# Altium schematic sheet 06_USB_Type-C_DFP.SchDoc: USB-C Connectors
size A2; Organization: Greenfield Tech Solutions; Address1: Molendreef 33; Address2: Ossendrecht; Address3: 4641CS; Address4: The Netherlands; SheetNumber: 6; SheetTotal: 11
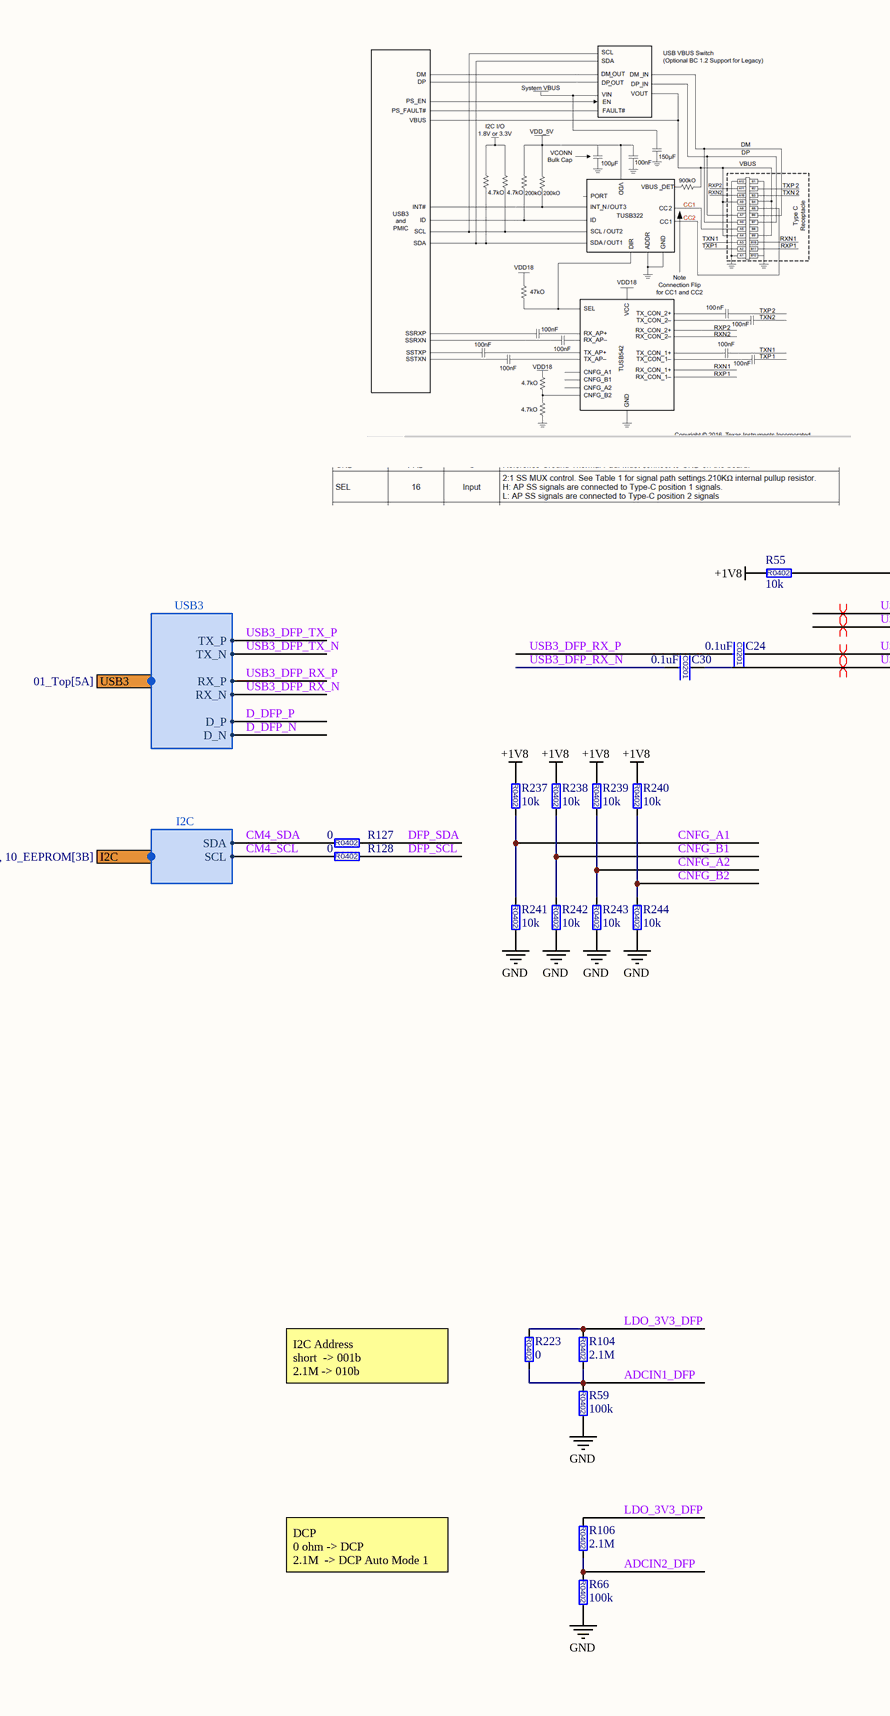
[diagram p0: 06_USB_Type-C_DFP.SchDoc, left]
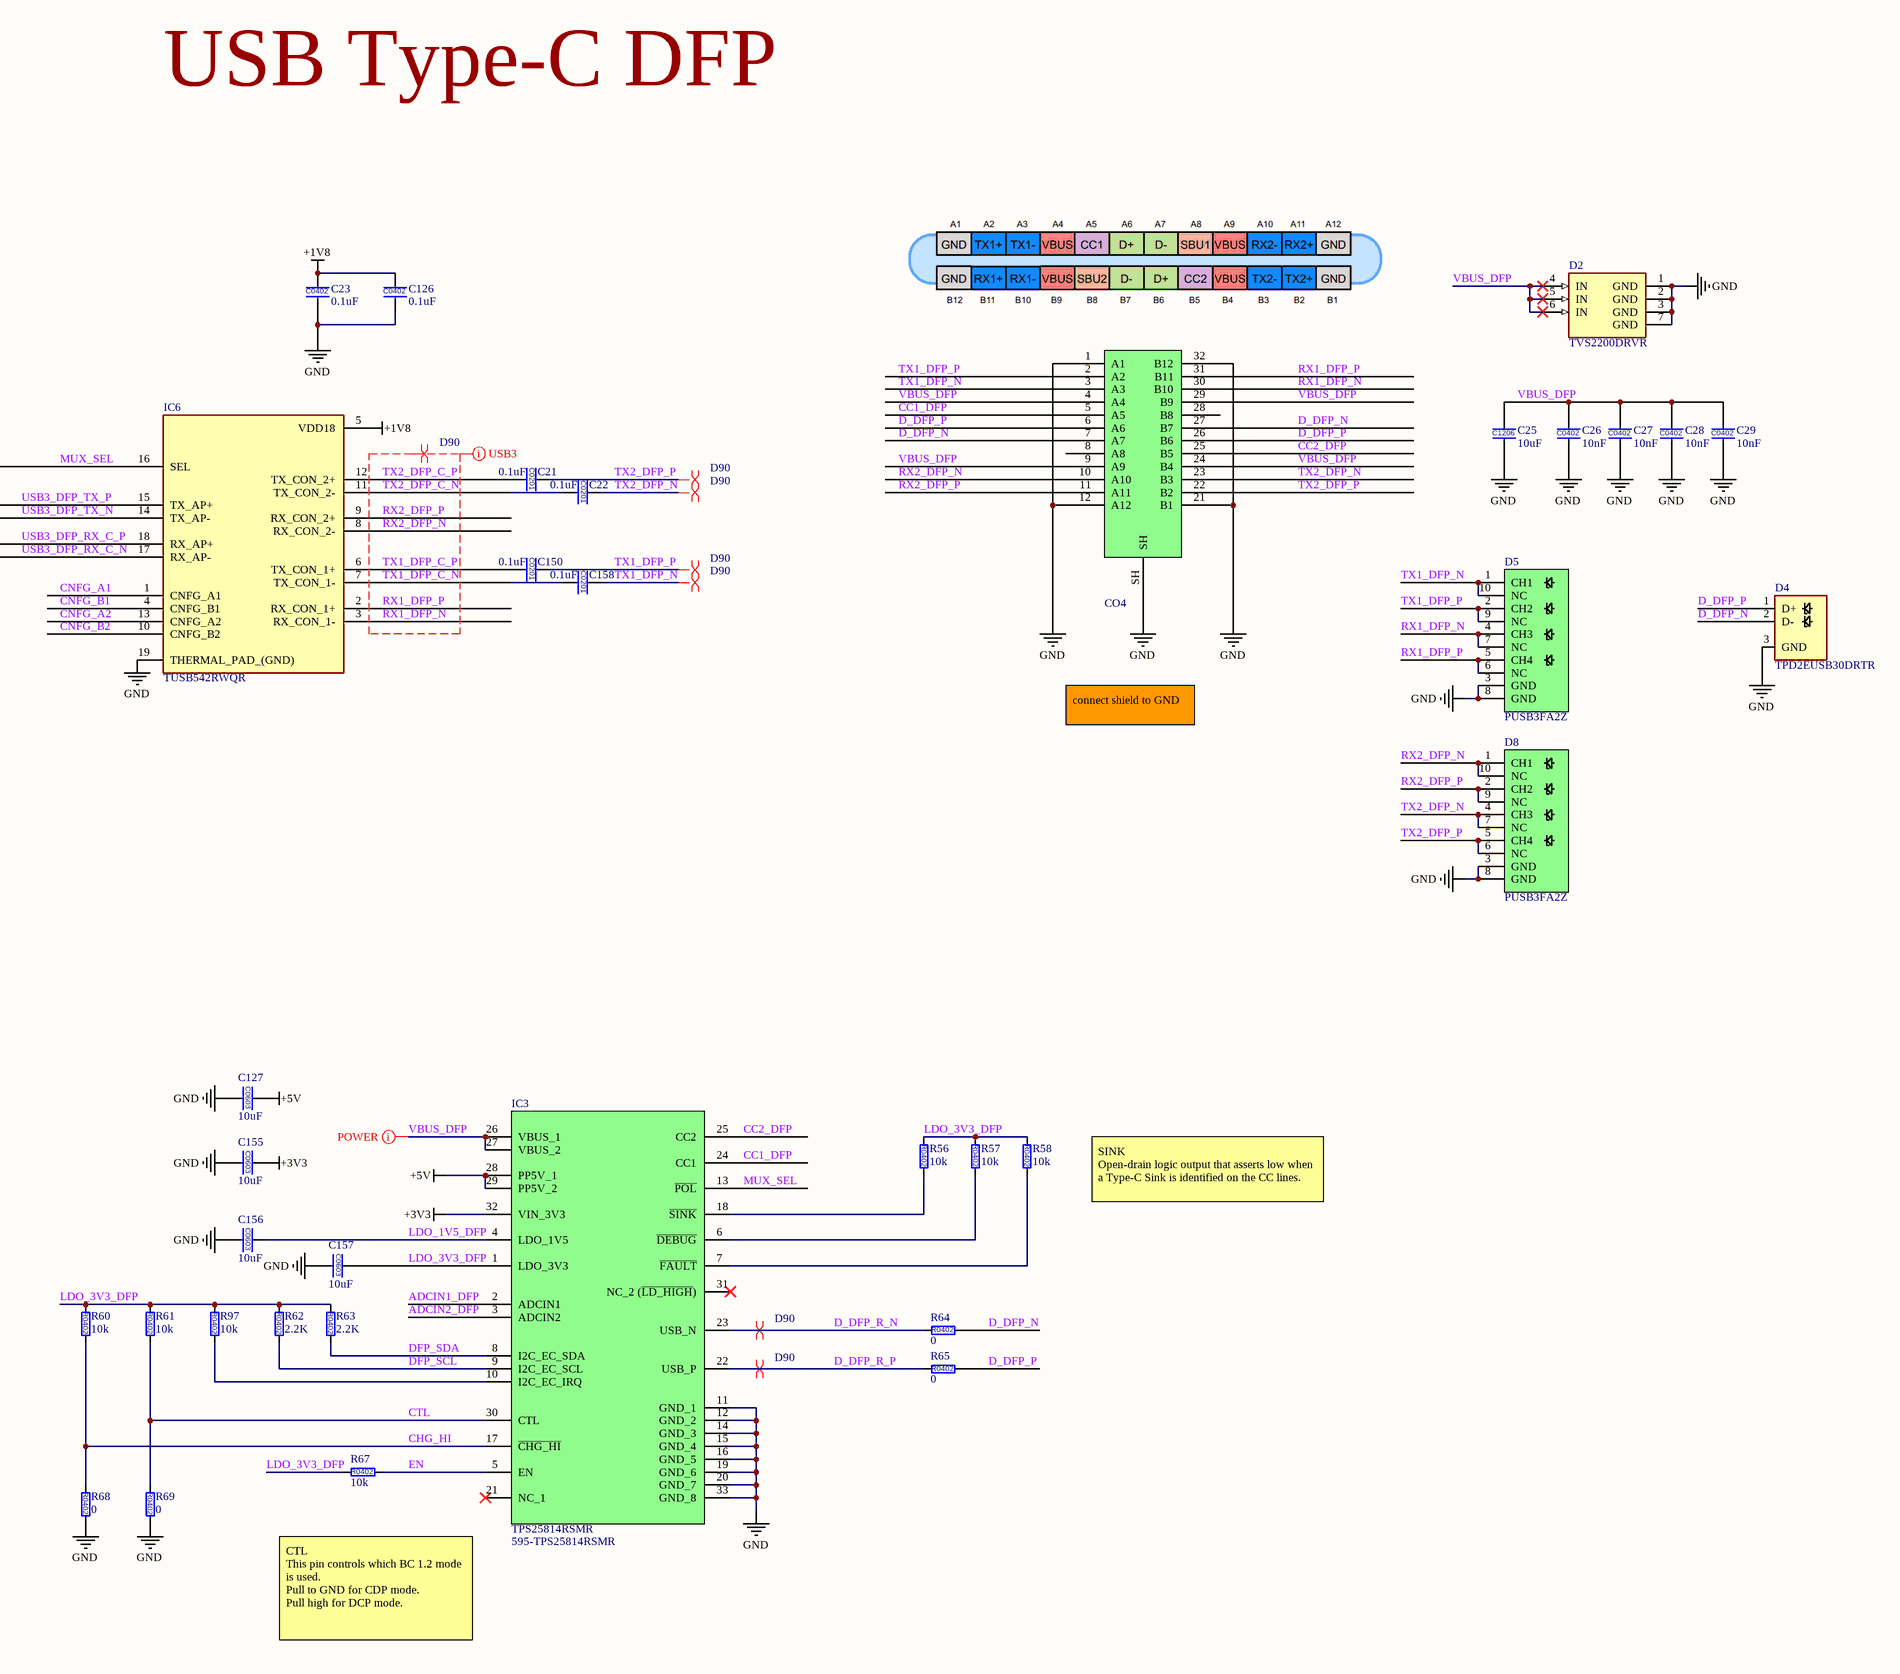
[diagram p1: 06_USB_Type-C_DFP.SchDoc, right]

## Parts
C21  0.1uF  [C0201]
C22  0.1uF  [C0201]
C23  0.1uF  [C0402]
C24  0.1uF  [C0201]
C25  10uF  [C1206]
C26  10nF  [C0402]
C27  10nF  [C0402]
C28  10nF  [C0402]
C29  10nF  [C0402]
C30  0.1uF  [C0201]
C126  0.1uF  [C0402]
C127  10uF  [C0603]
C150  0.1uF  [C0201]
C155  10uF  [C0603]
C156  10uF  [C0603]
C157  10uF  [C0603]
C158  0.1uF  [C0201]
CO4  USB4070-30-C  [USB4070-30-C]  (value not drawn)
D2  TVS2200DRVR  [TVS2200D_SON_6]
D4  TPD2EUSB30DRTR  [TPD2EUSB30DRTR_SOT-3]
D5  PUSB3FA2Z  [PUSB3FA2Z_DFN_2510_10]
D8  PUSB3FA2Z  [PUSB3FA2Z_DFN_2510_10]
IC3  TPS25814RSMR  Supplier Part Number 1: 595-TPS25814RSMR  [TPS25814RSMR_VQFN_32]
IC6  TUSB542RWQR  [TUSB542_X2QFN_18]
R55  10k  [R0402]
R56  10k  [R0402]
R57  10k  [R0402]
R58  10k  [R0402]
R59  100k  [R0402]
R60  10k  [R0402]
R61  10k  [R0402]
R62  2.2K  [R0402]
R63  2.2K  [R0402]
R64  0  [R0402]
R65  0  [R0402]
R66  100k  [R0402]
R67  10k  [R0402]
R68  0  [R0402]
R69  0  [R0402]
R97  10k  [R0402]
R104  2.1M  [R0402]
R106  2.1M  [R0402]
R127  0  [R0402]
R128  0  [R0402]
R223  0  [R0402]
R237  10k  [R0402]
R238  10k  [R0402]
R239  10k  [R0402]
R240  10k  [R0402]
R241  10k  [R0402]
R242  10k  [R0402]
R243  10k  [R0402]
R244  10k  [R0402]

## Ports
I2C (harness I2C, see 01_Top[4A], 03_RPiCM4[1B], 05_HDMI_to_DP[1B], 07_USB_Type-C_DFP_DP_ALT[1B], 08_USB_Type-C_DFP_DP_ALT_buttom[1B], 09_RTC[3B], 10_EEPROM[3B]), USB3 (harness USB3, see 01_Top[5A])

## Harnesses
USB3: TX_P, TX_N, RX_P, RX_N, D_P, D_N
I2C: SDA, SCL

## Nets
+1V8: C23.1 C126.1 IC6.5(VDD18) R55.1 R237.1 R238.1 R239.1 R240.1
+3V3: C155.1 IC3.32(VIN_3V3)
+5V: C127.1 IC3.28(PP5V_1) IC3.29(PP5V_2)
GND: C23.2 C25.2 C26.2 C27.2 C28.2 C29.2 C126.2 C127.2 C155.2 C156.2 C157.2 CO4.1(A1) CO4.12(A12) CO4.21(B1) CO4.32(B12) CO4.SH D2.1(GND) D2.2(GND) D2.3(GND) D2.7(GND) D4.3(GND) D5.3(GND) D5.8(GND) D8.3(GND) D8.8(GND) IC3.11(GND_1) IC3.12(GND_2) IC3.14(GND_3) IC3.15(GND_4) IC3.16(GND_5) IC3.19(GND_6) IC3.20(GND_7) IC3.33(GND_8) IC6.19(THERMAL_PAD_(GND)) R59.2 R66.2 R68.2 R69.2 R241.2 R242.2 R243.2 R244.2
ADCIN1_DFP: IC3.2(ADCIN1) R59.1 R104.2 R223.2
ADCIN2_DFP: IC3.3(ADCIN2) R66.1 R106.2
CC1_DFP: CO4.5(A5) IC3.24(CC1)
CC2_DFP: CO4.25(B5) IC3.25(CC2)
CHG_HI: IC3.17(~{CHG_HI}) R60.2 R68.1
CM4_SCL: R128.1 ; port I2C.SCL
CM4_SDA: R127.1 ; port I2C.SDA
CNFG_A1: IC6.1(CNFG_A1) R237.2 R241.1
CNFG_A2: IC6.13(CNFG_A2) R239.2 R243.1
CNFG_B1: IC6.4(CNFG_B1) R238.2 R242.1
CNFG_B2: IC6.10(CNFG_B2) R240.2 R244.1
CTL: IC3.30(CTL) R61.2 R69.1
D_DFP_N: CO4.7(A7) CO4.27(B7) D4.2(D-) R64.2 ; port USB3.D_N
D_DFP_P: CO4.6(A6) CO4.26(B6) D4.1(D+) R65.2 ; port USB3.D_P
D_DFP_R_N: IC3.23(USB_N) R64.1
D_DFP_R_P: IC3.22(USB_P) R65.1
DFP_SCL: IC3.9(I2C_EC_SCL) R62.2 R128.2
DFP_SDA: IC3.8(I2C_EC_SDA) R63.2 R127.2
EN: IC3.5(EN) R67.2
LDO_1V5_DFP: C156.1 IC3.4(LDO_1V5)
LDO_3V3_DFP: C157.1 IC3.1(LDO_3V3) R56.1 R57.1 R58.1 R60.1 R61.1 R62.1 R63.1 R67.1 R97.1 R104.1 R106.1 R223.1
MUX_SEL: IC3.13(~{POL}) IC6.16(SEL) R55.2
RX1_DFP_N: CO4.30(B10) D5.4(CH3) D5.7(NC) IC6.3(RX_CON_1-)
RX1_DFP_P: CO4.31(B11) D5.5(CH4) D5.6(NC) IC6.2(RX_CON_1+)
RX2_DFP_N: CO4.10(A10) D8.1(CH1) D8.10(NC) IC6.8(RX_CON_2-)
RX2_DFP_P: CO4.11(A11) D8.2(CH2) D8.9(NC) IC6.9(RX_CON_2+)
TX1_DFP_C_N: C158.2 IC6.7(TX_CON_1-)
TX1_DFP_C_P: C150.2 IC6.6(TX_CON_1+)
TX1_DFP_N: C158.1 CO4.3(A3) D5.1(CH1) D5.10(NC)
TX1_DFP_P: C150.1 CO4.2(A2) D5.2(CH2) D5.9(NC)
TX2_DFP_C_N: C22.2 IC6.11(TX_CON_2-)
TX2_DFP_C_P: C21.2 IC6.12(TX_CON_2+)
TX2_DFP_N: C22.1 CO4.23(B3) D8.4(CH3) D8.7(NC)
TX2_DFP_P: C21.1 CO4.22(B2) D8.5(CH4) D8.6(NC)
USB3_DFP_RX_C_N: C30.1 IC6.17(RX_AP-)
USB3_DFP_RX_C_P: C24.1 IC6.18(RX_AP+)
USB3_DFP_RX_N: C30.2 ; port USB3.RX_N
USB3_DFP_RX_P: C24.2 ; port USB3.RX_P
USB3_DFP_TX_N: IC6.14(TX_AP-) ; port USB3.TX_N
USB3_DFP_TX_P: IC6.15(TX_AP+) ; port USB3.TX_P
VBUS_DFP: C25.1 C26.1 C27.1 C28.1 C29.1 CO4.4(A4) CO4.9(A9) CO4.24(B4) CO4.29(B9) D2.4(IN) D2.5(IN) D2.6(IN) IC3.26(VBUS_1) IC3.27(VBUS_2)
NetIC3_6: IC3.6(~{DEBUG}) R57.2
NetIC3_7: IC3.7(~{FAULT}) R58.2
NetIC3_10: IC3.10(I2C_EC_IRQ) R97.2
NetIC3_18: IC3.18(~{SINK}) R56.2

Not connected (* = marked no-connect by the designer): CO4 8(A8) 28(B8); IC3 21(NC_1)* 31(NC_2_(~{LD_HIGH}))*

## Layout directives
differential pair; differential pair class USB3: USB3_DFP_RX_C_N, USB3_DFP_RX_C_P, USB3_DFP_TX_N, USB3_DFP_TX_P
net class USB3: RX1_DFP_N, RX1_DFP_P, RX2_DFP_N, RX2_DFP_P, TX1_DFP_C_N, TX1_DFP_C_P, TX2_DFP_C_N, TX2_DFP_C_P
differential pair; differential pair class D90: D_DFP_R_N, D_DFP_R_P, RX1_DFP_N, RX1_DFP_P, RX2_DFP_N, RX2_DFP_P, TX1_DFP_C_N, TX1_DFP_C_P, TX1_DFP_N, TX1_DFP_P, TX2_DFP_C_N, TX2_DFP_C_P, TX2_DFP_N, TX2_DFP_P
net class POWER: VBUS_DFP

## Notes on the sheet
- USB Type-C DFP
- connect shield to GND
- SINK
  Open-drain logic output that asserts low when a Type-C Sink is identified on the CC lines.
- I2C Address
  short  -> 001b
  2.1M -> 010b
- DCP
  0 ohm -> DCP
  2.1M  -> DCP Auto Mode 1
- CTL
  This pin controls which BC 1.2 mode is used.
  Pull to GND for CDP mode.
  Pull high for DCP mode.
- Title
- Size:
- Date:
- File:
- A2
- Number:
- Time:
- Revision:
- Sheet
- of
- (in symbol 0603ZD106KAT2A) C0603
- (in symbol 02016D104KAT) C0201
- (in symbol 04023D104KAT2A) C0402
- (in symbol 04025C103JAT2A) C0402
- (in symbol 12065D106KAT4A) C1206
- (in symbol CRCW04022K20FK) R0402
- (in symbol CRCW04022M10FKED) R0402
- (in symbol CRCW040210K0FK) R0402
- (in symbol CRCW0402100KFKEDC) R0402
- (in symbol CRCW04020000Z0) R0402

## Library data of the parts
C21 C22 C24 C30 C150 C158 = 02016D104KAT: CAP CER  0.1uF 10% 6.3V X5R 0201; Manufacturer: AVX Corporation; Capacitance: 100nF; Category: Capacitors; Manufacturer Part Number: 02016D104KAT; Operating Temperature: -55°C ~ 85°C; Package / Case: 0201; Value: 0.1uF; Voltage - Rated: 6.3V; Supplier: Digi-Key; Tolerance: ±10%; Temperature Coefficient: X5R; Mounting Type: Surface Mount, MLCC
C23 C126 = 04023D104KAT2A: CAP CER  0.1uF 10% 25V X5R 0402; Manufacturer: AVX Corporation; Manufacturer Part Number: 04023D104KAT2A; Value: 0.1uF; Voltage - Rated: 25V; Tolerance: ±10%; Temperature Coefficient: X5R
C25 = 12065D106KAT4A: CAP CER  10uF 10% 50V X5R 1206; Manufacturer: KYOCERA AVX; Value: 10µF; check: ok; Manufacturer Part Number: 12065D106KAT4A; Tolerance: ±10%; Voltage - Rated: 50V; Temperature Coefficient: X5R
C26-C29 = 04025C103JAT2A: CAP CER 10nF 5% 50V X7R 0402; Manufacturer: KYOCERA AVX; Manufacturer Part Number: 04025C103JAT2A; Operating Temperature: -55°C ~ 125°C; Package / Case: 0402 (1005 Metric); Value: 10nF; Voltage - Rated: 50V; Tolerance: ±5%; Temperature Coefficient: X7R
C127 C155-C157 = 0603ZD106KAT2A: CAP CER 10uF 10% 10V X5R 0603; Manufacturer: KYOCERA AVX; Value: 10µF; Manufacturer Part Number: 0603ZD106KAT2A; Tolerance: ±10%; Voltage - Rated: 10V; Temperature Coefficient: X5R
CO4 = USB4070-30-C: 24 Position 20 VDC USB Type C Horizontal USB 3.1 Receptacle Connector; Part Number: CO0021; Manufacturer: Global Connector Technology; ID: 16; USB Standard: USB 3.1; Number of Contacts: 24; Number of Ports: 1; Mating Cycles: 10000; Shielding: Shielded; ManfactPart: USB4070-30-C; Supplier 1: Farnell; Manufacturer Part Number: USB4070-30-C; RoHS: No; Category: USB Connectors; Stock 1: 87; Pricing 1: 1=3.37000, 10=2.90000, 30=2.83000, 80=2.69000, 200=2.64000 (GBP); Mount: Surface Mount,Through Hole,Vertical; Contact Material: Copper Alloy; Contact Plating: Gold; Insulation Color: Black; Min Operating Temperature: -40°C; Max Operating Temperature: 85°C; Gender: Receptacle; Orientation: Vertical; Connector Type: USB; Series: USB4070; Packaging: Tape and Reel; Termination: Solder; Reach SVHC Compliant: Yes; Lead Free: Lead Free; Flammability Rating: UL94 V-0; ComponentLink1URL: http://www.farnell.com/datasheets/2342947.pdf?src-supplier=Farnell; ComponentLink1Description: http://www.farnell.com/datasheets/2342947.pdf?src-supplier=Farnell; ComponentLink2URL: http://www.farnell.com/cad/2113628.pdf?src-supplier=Element14; ComponentLink2Description: http://www.farnell.com/cad/2113628.pdf?src-supplier=Element14; ComponentLink3URL: http://www.farnell.com/datasheets/2342947.pdf?src-supplier=Newark; ComponentLink3Description: http://www.farnell.com/datasheets/2342947.pdf?src-supplier=Newark; RefVal: USB4070; Supplier Part Number 1: 2784985
D2 = TVS2200DRVR: 22-V flat-clamp surge protection device 6-WSON -40 to 125; Manufacturer: Texas Instruments; Reverse Standoff Voltage: 22V; Standoff Height: 0mm; Clamping Voltage: 27.7V; Number Of Channels: 1; Capacitance: 105pF; Value: 105pF; Direction: Unidirectional; Breakdown Voltage: 24.6V; Peak Pulse Current: 40A; Package: DRV0006A; Category: Diode; Device Class L3: unset; Device Class L1: Circuit Protection; Temperature: -40°C to +125°C; ComponentLink2Description: Datasheet; Height: 0.8mm; Ambient Temperature Range Low: -40°C; Octopart: https://octopart.com/tvs2200drvr-texas+instruments-88217346; Temperature Range High: +125°C; Automotive: No; Temperature Range Low: -40°C; Ipc Land Pattern Name: DFN200X200X75-6; Manufacturer Part Number: TVS2200DRVR; Device Class L2: ESD and Circuit Protection ICs; RoHS: TRUE; Lead Free: Yes; Ambient Temperature Range High: +125°C; Mouser Description: Diode TVS Single Uni-Dir 22V 1.12KW 6-Pin WSON EP T/R; ComponentLink2URL: http://www.ti.com/lit/ds/symlink/tvs2200.pdf; Digikey Description: UNIDIR PRECISION SURGE DIODE; Supplier 1: Mouser; Pricing 1: 1=0.56000, 10=0.47800, 50=0.44600, 100=0.35700, 1000=0.21700, 10000=0.19700 (USD); Mount: Surface Mount; Min Operating Temperature: -40°C; Max Operating Temperature: 125°C; Packaging: Tape and Reel; Number of Circuits: 1; RoHS Compliant: Yes; ComponentLink1URL: http://www.ti.com/lit/ds/symlink/tvs2200.pdf?src-supplier=Digi-Key; ComponentLink1Description: http://www.ti.com/lit/ds/symlink/tvs2200.pdf?src-supplier=Digi-Key; ComponentLink3URL: http://www.ti.com/general/docs/suppproductinfo.tsp?distId=10&amp;gotoUrl=http%3A%2F%2Fwww.ti.com%2Flit%2Fgpn%2Ftvs2200&src-supplier=Digi-Key; ComponentLink3Description: http://www.ti.com/general/docs/suppproductinfo.tsp?distId=10&amp;gotoUrl=http%3A%2F%2Fwww.ti.com%2Flit%2Fgpn%2Ftvs2200&src-supplier=Digi-Key; Supplier Part Number 1: 595-TVS2200DRVR
D4 = TPD2EUSB30DRTR: Dual 0.7-pF, 5.5-V ±8-kV ESD protection diode with 5-A surge rating for USB 3.0 3-SOT-9X3 -40 to 85; Manufacturer: Texas Instruments; Direction: Bidirectional,Unidirectional; Capacitance: 0.8pF; Number of Bidirectional Channels: 2; Reverse Standoff Voltage: 5.5V; Min Breakdown Voltage: 9V; Clamping Voltage: 8V; Peak Pulse Power: 45W; Power Line Protection: Yes; Test Current: 1mA; Peak Pulse Current: 1A; Supplier 1: Mouser; Manufacturer Part Number: TPD2EUSB30DRTR; RoHS: Yes; Category: Integrated Circuits (ICs); Pricing 1: 1=0.66000, 10=0.56100, 50=0.56000, 100=0.41900, 1000=0.25500, 10000=0.23100 (USD); Case/Package: SOT; Number of Pins: 3; Min Operating Temperature: -40°C; Max Operating Temperature: 85°C; Packaging: Tape and Reel; Package Quantity: 1; Breakdown Voltage: 9V; Number of Channels: 2; Working Voltage: 5.5V; ESD Protection: Yes; Element Configuration: Dual; Interface: USB; Series: -; Number of Unidirectional Channels: 2; Length: 1mm; Width: 0.85mm; Height: 0.45mm; Depth: 0.8mm; Radiation Hardening: No; Reach SVHC Compliant: Yes; Lead Free: Lead Free; RoHS Compliant: Yes; ComponentLink1URL: https://datasheet.ciiva.com/1611/tpd2eusb30-1611602.pdf?src-supplier=Newark; ComponentLink1Description: https://datasheet.ciiva.com/1611/tpd2eusb30-1611602.pdf?src-supplier=Newark; ComponentLink2URL: https://datasheet.ciiva.com/15134/getdatasheetpartid-202713-15134479.pdf?src-supplier=Verical; ComponentLink2Description: https://datasheet.ciiva.com/15134/getdatasheetpartid-202713-15134479.pdf?src-supplier=Verical; ComponentLink3URL: https://datasheet.ciiva.com/1504/1882087-1504248.pdf?src-supplier=Element14; ComponentLink3Description: https://datasheet.ciiva.com/1504/1882087-1504248.pdf?src-supplier=Element14; ComponentLink4URL: https://datasheet.ciiva.com/353/tpd2eusb30-353273.pdf?src-supplier=Digi-Key; ComponentLink4Description: https://datasheet.ciiva.com/353/tpd2eusb30-353273.pdf?src-supplier=Digi-Key; ComponentLink5URL: https://datasheet.ciiva.com/353/tpd2eusb30-353272.pdf?src-supplier=Digi-Key; ComponentLink5Description: https://datasheet.ciiva.com/353/tpd2eusb30-353272.pdf?src-supplier=Digi-Key; ComponentLink6URL: https://datasheet.ciiva.com/353/tpd2eusb30-353274.pdf?src-supplier=Digi-Key; ComponentLink6Description: https://datasheet.ciiva.com/353/tpd2eusb30-353274.pdf?src-supplier=Digi-Key; Supplier Part Number 1: 595-TPD2EUSB30DRTR
D5 D8 = PUSB3FA2Z: PUSB3FA2/SOT1176/XSON10; Part Number: DI0007; Manufacturer: Nexperia; ID: 7; RefVal: TVS; ManfactPart: PUSB3FA2Z; Supplier 1: Digi-Key; Manufacturer Part Number: PUSB3FA2Z; RoHS: No; Category: TVS Diodes; Stock 1: 8565; Pricing 1: 1=0.39000, 10=0.31700, 100=0.21570, 500=0.16178, 1000=0.12134, 2000=0.11123 (USD); ComponentLink1URL: http://www.farnell.com/datasheets/2621625.pdf?src-supplier=Farnell; ComponentLink1Description: http://www.farnell.com/datasheets/2621625.pdf?src-supplier=Farnell; ComponentLink2URL: https://assets.nexperia.com/documents/data-sheet/PUSB3FA2.pdf?src-supplier=Digi-Key; ComponentLink2Description: https://assets.nexperia.com/documents/data-sheet/PUSB3FA2.pdf?src-supplier=Digi-Key; ComponentLink3URL: http://www.farnell.com/datasheets/2621625.pdf?src-supplier=Newark; ComponentLink3Description: http://www.farnell.com/datasheets/2621625.pdf?src-supplier=Newark; Supplier Part Number 1: 1727-7813-1-ND; Supplier 2: Farnell; Stock 2: 8440; Pricing 2: 5=0.31600, 10=0.25800, 100=0.17600, 500=0.13300, 1000=0.11400, 5000=0.09420 (GBP); Supplier 3: Digi-Key; Stock 3: 5000; Pricing 3: 5000=0.10449, 10000=0.09774, 25000=0.09450 (USD); Supplier Part Number 3: 1727-7813-2-ND; Supplier Part Number 2: 2901054
IC3 = TPS25814RSMR: USB Type-C® controller with integrated source power switch 32-VQFN -40 to 105; Manufacturer_Name: Texas Instruments; Datasheet Link: https://www.ti.com/lit/ds/symlink/tps25814.pdf?ts=1614246005864&ref_url=https%253A%252F%252Fwww.mouser.it%252F; Height: 1mm; Manufacturer_Part_Number: TPS25814RSMR; Mouser Part Number: 595-TPS25814RSMR; Mouser Price/Stock: https://www.mouser.co.uk/ProductDetail/Texas-Instruments/TPS25814RSMR?qs=eP2BKZSCXI7b%2F2SE6IEFzg%3D%3D; Supplier 1: Mouser; Manufacturer: Texas Instruments; Manufacturer Part Number: TPS25814RSMR; RoHS: No; Category: Integrated Circuits (ICs); Pricing 1: 1=2.50000, 10=2.25000, 50=2.12000, 100=1.81000, 1000=1.24000, 10000=1.23000 (USD)
IC6 = TUSB542RWQR: Integrated Circuit; Manufacturer_Name: Texas Instruments; Datasheet Link: http://www.ti.com/lit/ds/symlink/tusb542.pdf; Manufacturer_Part_Number: TUSB542RWQR; Mouser Part Number: 595-TUSB542RWQR; Mouser Price/Stock: https://www.mouser.co.uk/ProductDetail/Texas-Instruments/TUSB542RWQR?qs=n%252BTO0c4TDSbKMyA4z73fLg%3D%3D; Arrow Part Number: TUSB542RWQR; Arrow Price/Stock: https://www.arrow.com/en/products/tusb542rwqr/texas-instruments
R55-R58 R60 R61 R67 R97 R237-R244 = CRCW040210K0FK: RES SMD 10K ohm 1% 1/16W R0402; Manufacturer: Vishay; check: ok; Manufacturer Part Number: CRCW040210K0FK; Value: 10K; Power (Watts): 1/16W; Package / Case: 0402; Tolerance: ±1%
R59 R66 = CRCW0402100KFKEDC: RES SMD 100K ohm 1% 1/16W R0402; Manufacturer: Vishay; check: ok; Manufacturer Part Number: CRCW0402100KFKEDC; Value: 100K; Power (Watts): 1/16W; Package / Case: 0402; Tolerance: ±1%
R62 R63 = CRCW04022K20FK: RES SMD 2.2K ohm 1% 1/16W R0402; Manufacturer: Vishay; check: ok; Manufacturer Part Number: CRCW04022K20FK; Value: 2.2K; Power (Watts): 1/16W; Package / Case: 0402; Tolerance: ±1%
R64 R65 R68 R69 R223 = CRCW04020000Z0: RES SMD 0 ohm 1/16W R0402; Manufacturer: Vishay Dale; Manufacturer Part Number: CRCW04020000Z0; Value: 0; Power (Watts): 1/16W; Package / Case: 0402
R104 R106 = CRCW04022M10FKED: RES SMD 2.1M ohm 1% 1/16W R0402; Manufacturer: Vishay; check: ok; Manufacturer Part Number: CRCW04022M10FKED; Value: 2.1M; Power (Watts): 1/16W; Package / Case: 0402; Tolerance: ±1%
R127 R128 = CRCW04020000Z0: RES SMD 0 ohm 1/16W R0402; Manufacturer: Vishay Dale; check: ok; Manufacturer Part Number: CRCW04020000Z0; Value: 0; Power (Watts): 1/16W; Package / Case: 0402